# Altium project COTS_REVB.PrjPcb
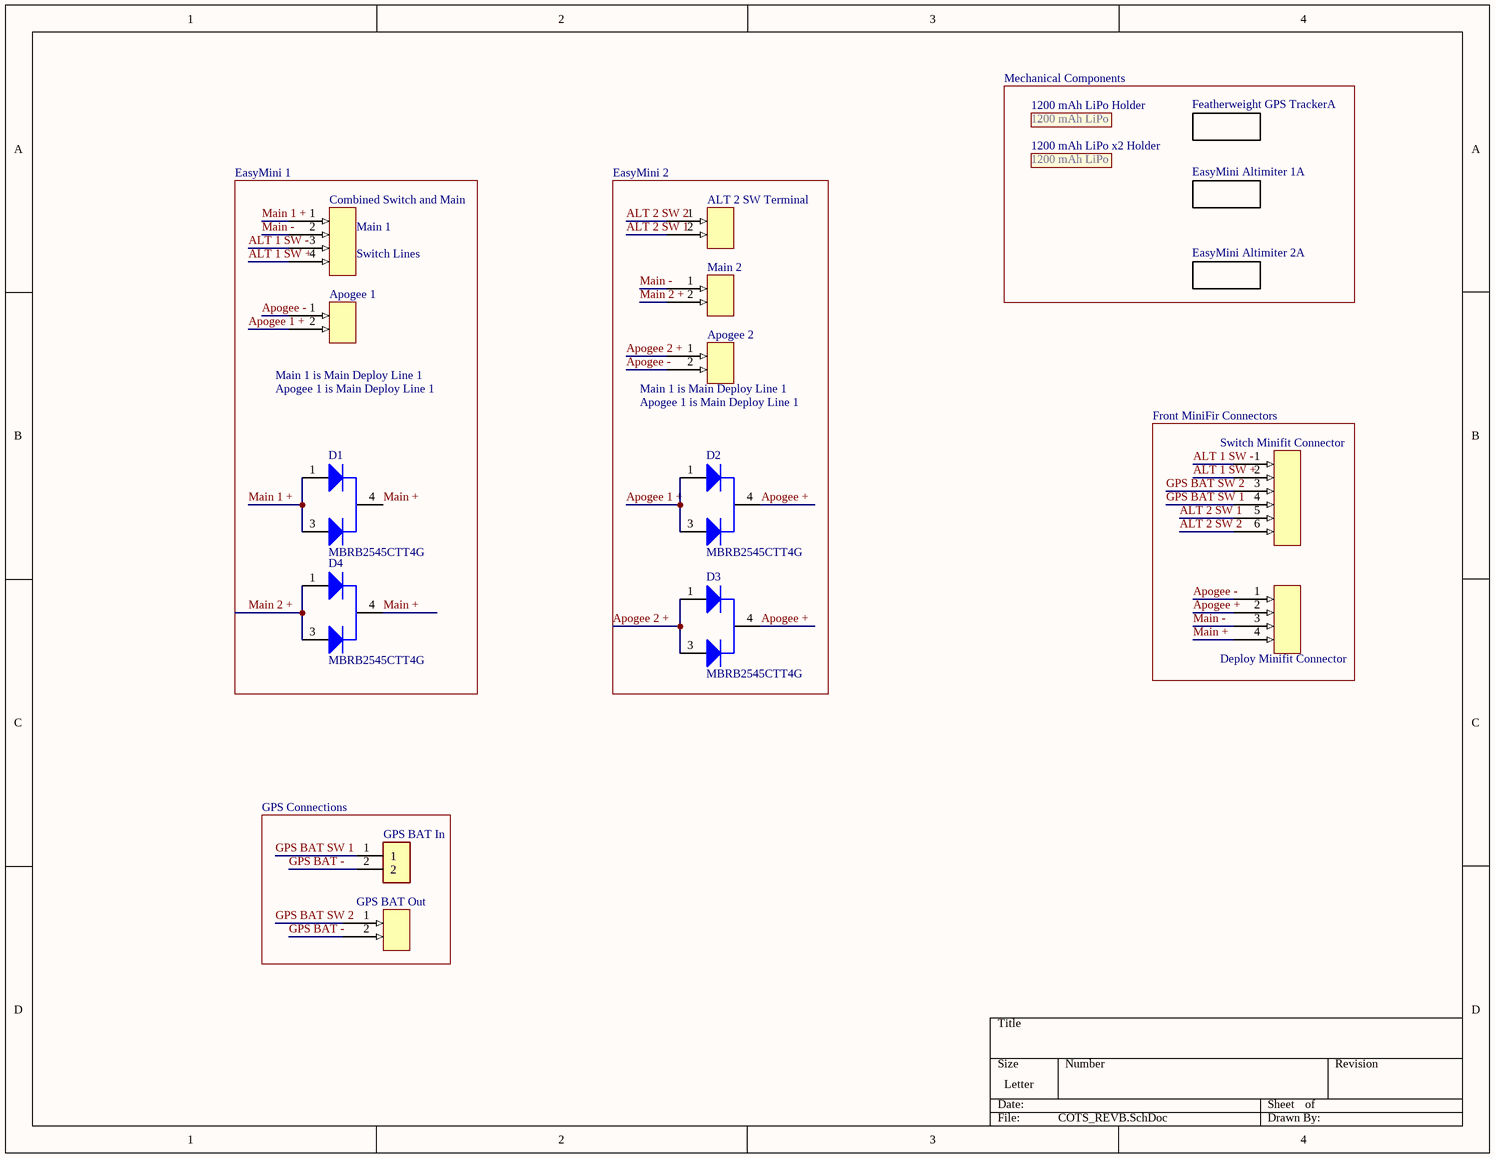
[diagram p0: COTS_REVB.SchDoc]
1 sheet, 18 parts. Net scope: global (net labels, ports and power ports of the same name join across sheets).
Board file: COTS_REVB.PcbDoc

## Sheet COTS_REVB.SchDoc
size Letter; SheetNumber: 1; SheetTotal: 1

### Parts
1200_mAh_LiPo_Holder  1200mAh LiPo x1 Holder  [LiPo Holder-Footprint-1]  (value not drawn)
1200_mAh_LiPo_x2_Holder  (no value)  [LiPo Holder-Footprint-1]
ALT_2_SW_Terminal  1984769  [1984769-Footprint-1]  (value not drawn)
Apogee_1  Terminal Block  [1984769-Footprint-1]  (value not drawn)
Apogee_2  Terminal Block  [1984769-Footprint-1]  (value not drawn)
Combined_Switch_and_Main  Terminal Block  [CONN_1984785_PXC]  (value not drawn)
D1  MBRB2545CTT4G  [ONSC-D2PAK-3-418B-04_V]
D2  MBRB2545CTT4G  [ONSC-D2PAK-3-418B-04_V]
D3  MBRB2545CTT4G  [ONSC-D2PAK-3-418B-04_V]
D4  MBRB2545CTT4G  [ONSC-D2PAK-3-418B-04_V]
Deploy_Minifit_Connector  (no value)  [10126480104-Footprint-1]
EasyMini_Altimiter_1  EasyMini  [EasyMini-Footprint-1]  (value not drawn)  (part A of 2)
EasyMini_Altimiter_2  EasyMini  [EasyMini-Footprint-1]  (value not drawn)  (part A of 2)
Featherweight_GPS_Tracker  Featherweight  [Featherweight-Footprint-1]  (value not drawn)  (part A of 2)
GPS_BAT_In  B2B-PH-K-S(LF)(SN)  [JST_B2B-PH-K-S(LF)(SN)]  (value not drawn)
GPS_BAT_Out  1984769  [1984769-Footprint-1]  (value not drawn)
Main_2  1984769  [1984769-Footprint-1]  (value not drawn)
Switch_Minifit_Connector  172648-0106  [New footprint 1]  (value not drawn)

### Blocks framed on the sheet
Mechanical Components: 1200_mAh_LiPo_Holder 1200_mAh_LiPo_x2_Holder EasyMini_Altimiter_1 EasyMini_Altimiter_2 Featherweight_GPS_Tracker
Front MiniFir Connectors: Deploy_Minifit_Connector Switch_Minifit_Connector
GPS Connections: GPS_BAT_In GPS_BAT_Out

### Nets
ALT 1 SW +: Combined_Switch_and_Main.4 Switch_Minifit_Connector.2
ALT 1 SW -: Combined_Switch_and_Main.3 Switch_Minifit_Connector.1
ALT 2 SW 1: ALT_2_SW_Terminal.2 Switch_Minifit_Connector.5
ALT 2 SW 2: ALT_2_SW_Terminal.1 Switch_Minifit_Connector.6
Apogee 1 +: Apogee_1.2 D2.1(A1) D2.3(A2)
Apogee 2 +: Apogee_2.1 D3.1(A1) D3.3(A2)
Apogee +: D2.4(K) D3.4(K) Deploy_Minifit_Connector.2
Apogee -: Apogee_1.1 Apogee_2.2 Deploy_Minifit_Connector.1
GPS BAT -: GPS_BAT_In.2 GPS_BAT_Out.2
GPS BAT SW 1: GPS_BAT_In.1 Switch_Minifit_Connector.4
GPS BAT SW 2: GPS_BAT_Out.1 Switch_Minifit_Connector.3
Main 1 +: Combined_Switch_and_Main.1 D1.1(A1) D1.3(A2)
Main 2 +: D4.1(A1) D4.3(A2) Main_2.2
Main +: D1.4(K) D4.4(K) Deploy_Minifit_Connector.4
Main -: Combined_Switch_and_Main.2 Deploy_Minifit_Connector.3 Main_2.1

### Notes on the sheet
- (near Combined_Switch_and_Main) EasyMini 1
- (near Combined_Switch_and_Main) Main 1
- (near ALT_2_SW_Terminal) EasyMini 2
- (near Combined_Switch_and_Main) Switch Lines
- (near Apogee_1) Main 1 is Main Deploy Line 1
- Apogee 1 is Main Deploy Line 1
- (near Apogee_2) Main 1 is Main Deploy Line 1
- (near Apogee_2) Apogee 1 is Main Deploy Line 1
- (in symbol CMP-00028-00011-11) 1200 mAh LiPo
- (in symbol CMP-00028-00013-5) 1200 mAh LiPo

### Library data of the parts
1200_mAh_LiPo_Holder = CMP-00028-00013-5: Holder for LiPo Pouch Type Battery
1200_mAh_LiPo_x2_Holder = CMP-00028-00011-11: Holder for LiPo Pouch Type Battery
ALT_2_SW_Terminal Apogee_1 Apogee_2 GPS_BAT_Out Main_2 = CMP-00028-00010-2: Terminal Block, Printed Circuit; 10 A; 160 V; 3.5 mm; 2; 3.5 mm; 1.2 mm; M2; PA
Combined_Switch_and_Main = CMP-00028-00012-3: Terminal Block, Printed Circuit, 10 A, 160 V, 3.5 mm, 4, 3.5 mm, 1.2 mm, M2, PA
D1-D4 = CMP-004-00032-1: Rectifier Diode Schottky 45V 30A 3-Pin(2+Tab) D2PAK T/R; Case/Package: D2PAK
Deploy_Minifit_Connector = CMP-00028-00012-4
EasyMini_Altimiter_1 EasyMini_Altimiter_2 = CMP-00028-00008-4
Featherweight_GPS_Tracker = CMP-00028-00009-2: Featherweight GPS tracker footprint
GPS_BAT_In = B2B-PH-K-S(LF)(SN): PH Series 2 Position 2 mm Pitch Through Hole Top Entry Shrouded Header; MF: {'manufacturer': u'JST Sales'}; Price: None; Package: None; Availability: Unavailable; MP: B2B-PH-K-S(LF)(SN); Value: *
Switch_Minifit_Connector = CMP-002-00071-2: Conn Power HDR 6 POS 4.2mm Solder RA Thru-Hole Tray